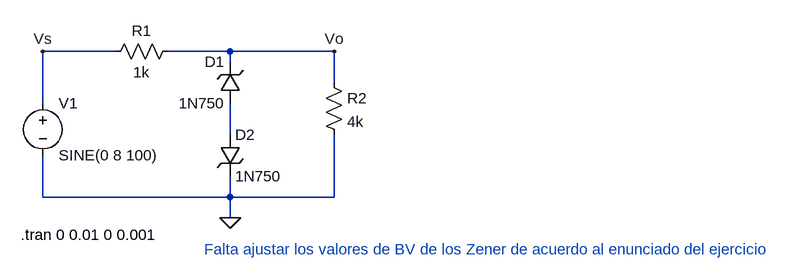
[diagram p0: schematic ej1_2.asc]
ej1_2.asc, the LTspice schematic file:
Version 4
SHEET 1 1348 680
WIRE 160 32 48 32
WIRE 336 32 240 32
WIRE 496 32 336 32
WIRE 336 48 336 32
WIRE 496 80 496 32
WIRE 48 112 48 32
WIRE 336 160 336 112
WIRE 48 256 48 192
WIRE 336 256 336 224
WIRE 336 256 48 256
WIRE 496 256 496 160
WIRE 496 256 336 256
WIRE 336 288 336 256
FLAG 496 32 Vo
FLAG 48 32 Vs
FLAG 336 288 0
SYMBOL voltage 48 96 R0
WINDOW 123 0 0 Left 2
WINDOW 39 0 0 Left 2
SYMATTR InstName V1
SYMATTR Value SINE(0 8 100)
SYMBOL res 256 16 R90
WINDOW 0 0 56 VBottom 2
WINDOW 3 32 56 VTop 2
SYMATTR InstName R1
SYMATTR Value 1k
SYMBOL zener 352 112 R180
WINDOW 0 24 64 Left 2
WINDOW 3 24 0 Left 2
SYMATTR InstName D1
SYMATTR Value 1N750
SYMBOL zener 320 160 R0
SYMATTR InstName D2
SYMATTR Value 1N750
SYMBOL res 480 64 R0
SYMATTR InstName R2
SYMATTR Value 4k
TEXT 14 314 Left 2 !.tran 0 0.01 0 0.001
TEXT 296 336 Left 2 ;Falta ajustar los valores de BV de los Zener de acuerdo al enunciado del ejercicio

The netlist it stands for:
* ej1_2.asc
V1 Vs 0 SINE(0 8 100)
R1 Vo Vs 1k
D1 N001 Vo 1N750
D2 N001 0 1N750
R2 Vo 0 4k
.model D D
.lib standard.dio
.tran 0 0.01 0 0.001
* Falta ajustar los valores de BV de los Zener de acuerdo al enunciado del ejercicio
.backanno
.end